# Altium schematic sheet Peripherals.SchDoc
size A4
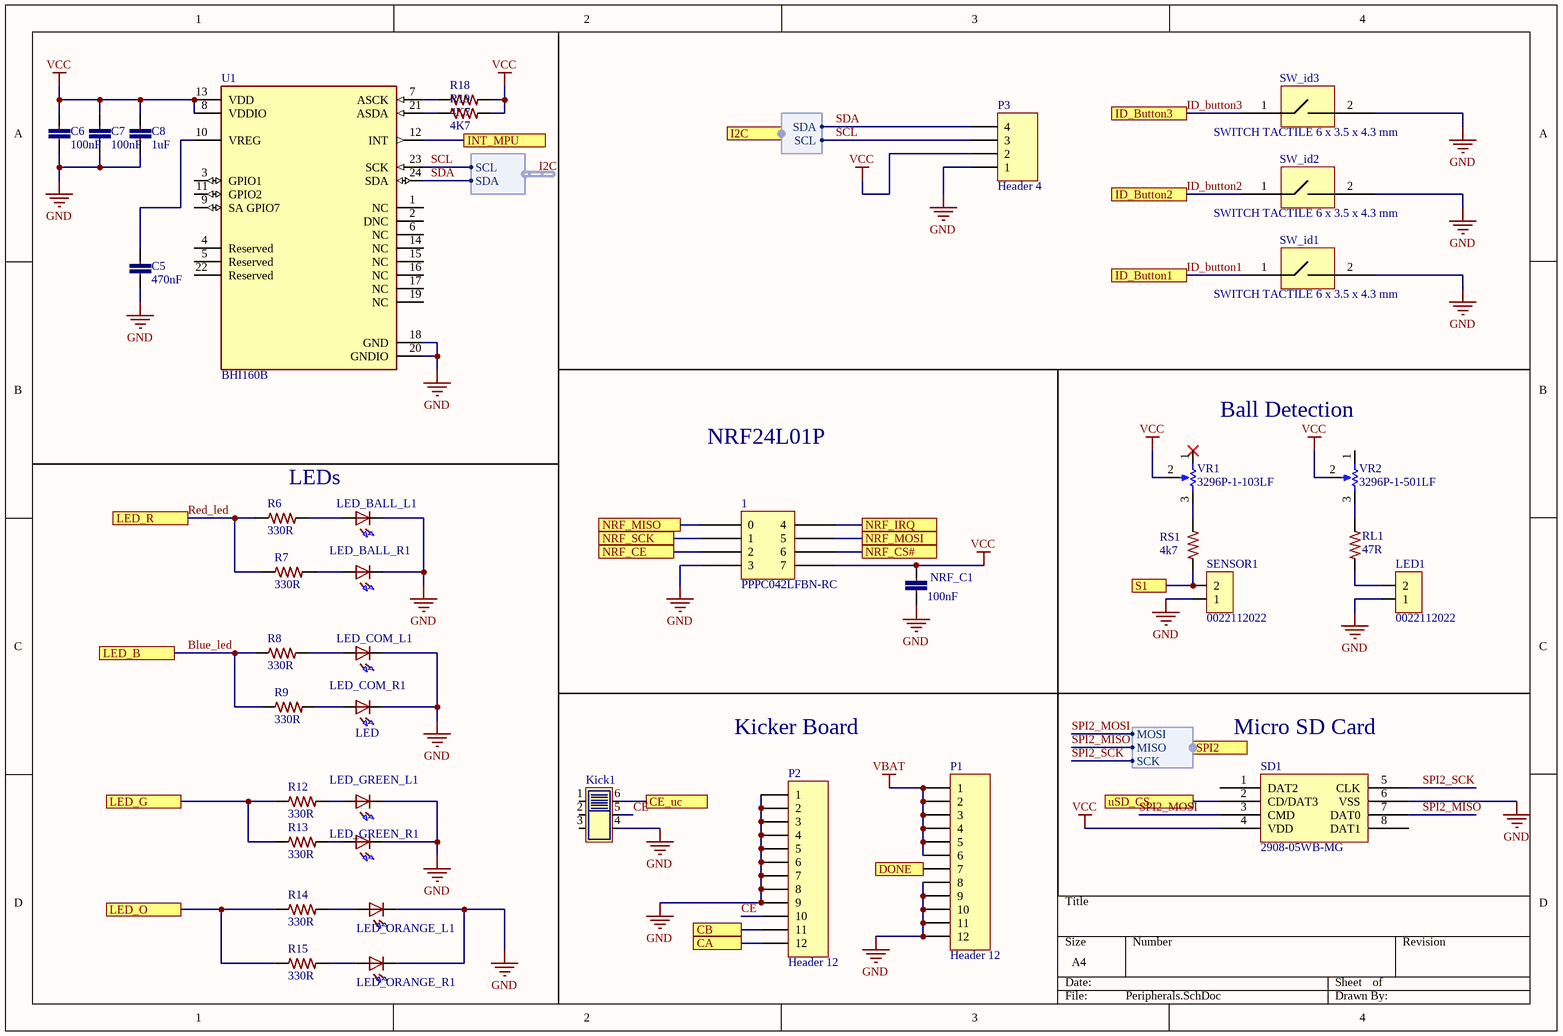
[diagram p0: Peripherals.SchDoc]

## Parts
1  PPPC042LFBN-RC  [04x02_Conector_Female]
C5  470nF  [0402-CAP]
C6  100nF  [0402-CAP]
C7  100nF  [0402-CAP]
C8  1uF  [0402-CAP]
Kick1  JS202011SCQN  [SOP250P750X350-6N]  (value not drawn)
LED1  0022112022  [02x01_Conector_Male]
LED_BALL_L1  LED  [LED-5MM-PCB]  (value not drawn)
LED_BALL_R1  LED  [LED-5MM-PCB]  (value not drawn)
LED_COM_L1  LED  [LED-5MM-PCB]  (value not drawn)
LED_COM_R1  LED  [LED-5MM-PCB]
LED_GREEN_L1  LED  [LED-5MM-PCB]  (value not drawn)
LED_GREEN_R1  LED  [LED-5MM-PCB]  (value not drawn)
LED_ORANGE_L1  LED  [LED-5MM-PCB]  (value not drawn)
LED_ORANGE_R1  LED  [LED-5MM-PCB]  (value not drawn)
NRF_C1  100nF  [0402-CAP]
P1  Header 12  [HDR1X12]
P2  Header 12  [HDR1X12]
P3  Header 4  [HDR1X4]
R6  330R  [0402-RES-HD]
R7  330R  [0402-RES-HD]
R8  330R  [0402-RES-HD]
R9  330R  [0402-RES-HD]
R12  330R  [0402-RES-HD]
R13  330R  [0402-RES-HD]
R14  330R  [0402-RES-HD]
R15  330R  [0402-RES-HD]
R18  4K7  [0805-RES]
R19  4K7  [0805-RES]
RL1  47R  [0402-RES-HD]
RS1  4k7  [0402-RES-HD]
SD1  2908-05WB-MG  [New footprint 1]
SENSOR1  0022112022  [02x01_Conector_Male]
SW_id1  SWITCH TACTILE 6 x 3.5 x 4.3 mm  [PCBComponent]
SW_id2  SWITCH TACTILE 6 x 3.5 x 4.3 mm  [PCBComponent]
SW_id3  SWITCH TACTILE 6 x 3.5 x 4.3 mm  [PCBComponent]
U1  BHI160B  [FP-BHI160B-MFG]
VR1  3296P-1-103LF  [3296P]
VR2  3296P-1-501LF  [3296P]

## Ports
CA, CB, CE_uc, DONE, I2C (harness I2C), ID_Button1, ID_Button2, ID_Button3, INT_MPU, LED_B, LED_G, LED_O, LED_R, NRF_CE, NRF_CS#, NRF_IRQ, NRF_MISO, NRF_MOSI, NRF_SCK, S1, SPI2 (harness SPI), uSD_CS

## Harnesses
I2C: SCL, SDA
SPI: MOSI, MISO, SCK

## Nets
GND: 1.3 C5.2 C6.2 C7.2 C8.2 Kick1.4 LED1.1 LED_BALL_L1.1(K) LED_BALL_R1.1(K) LED_COM_L1.1(K) LED_COM_R1.1(K) LED_GREEN_L1.1(K) LED_GREEN_R1.1(K) LED_ORANGE_L1.1(K) LED_ORANGE_R1.1(K) NRF_C1.2 P1.8 P1.9 P1.10 P1.11 P1.12 P2.1 P2.2 P2.3 P2.4 P2.5 P2.6 P2.7 P2.8 P2.9 P3.1 SD1.6(VSS) SENSOR1.1 SW_id1.2 SW_id2.2 SW_id3.2 U1.18(GND) U1.20(GNDIO)
VBAT: P1.1 P1.2 P1.3 P1.4 P1.5 P1.6
VCC: 1.7 C6.1 C7.1 C8.1 NRF_C1.1 P3.2 R18.2 R19.2 SD1.4(VDD) U1.8(VDDIO) U1.13(VDD) VR1.2(Wiper) VR2.2(Wiper)
Blue_led: R8.1 R9.1 ; port LED_B
CA: P2.12 ; port CA
CB: P2.11 ; port CB
CE: Kick1.5 P2.10
CE_uc: Kick1.6 ; port CE_uc
DONE: P1.7 ; port DONE
ID_button1: SW_id1.1 ; port ID_Button1
ID_button2: SW_id2.1 ; port ID_Button2
ID_button3: SW_id3.1 ; port ID_Button3
INT_MPU: U1.12(INT) ; port INT_MPU
LED_G: R12.1 R13.1 ; port LED_G
LED_O: R14.1 R15.1 ; port LED_O
NRF_CE: 1.2 ; port NRF_CE
NRF_CS#: 1.6 ; port NRF_CS#
NRF_IRQ: 1.4 ; port NRF_IRQ
NRF_MISO: 1.0 ; port NRF_MISO
NRF_MOSI: 1.5 ; port NRF_MOSI
NRF_SCK: 1.1 ; port NRF_SCK
Red_led: R6.1 R7.1 ; port LED_R
S1: RS1.1 SENSOR1.2 ; port S1
SCL: P3.3 U1.23(SCK) ; port I2C.SCL, harness I2C.SCL  [project net I2C.SCL]
SDA: P3.4 U1.24(SDA) ; port I2C.SDA, harness I2C.SDA  [project net I2C.SDA]
SPI2_MISO: SD1.7(DAT0) ; port SPI2.MISO
SPI2_MOSI: SD1.3(CMD) ; port SPI2.MOSI
SPI2_SCK: SD1.5(CLK) ; port SPI2.SCK
uSD_CS: SD1.2(CD/DAT3) ; port uSD_CS
NetC5_1: C5.1 U1.10(VREG)
NetLED1_2: LED1.2 RL1.2
NetLED_BALL_L1_2: LED_BALL_L1.2(A) R6.2
NetLED_BALL_R1_2: LED_BALL_R1.2(A) R7.2
NetLED_COM_L1_2: LED_COM_L1.2(A) R8.2
NetLED_COM_R1_2: LED_COM_R1.2(A) R9.2
NetLED_GREEN_L1_2: LED_GREEN_L1.2(A) R12.2
NetLED_GREEN_R1_2: LED_GREEN_R1.2(A) R13.2
NetLED_ORANGE_L1_2: LED_ORANGE_L1.2(A) R14.2
NetLED_ORANGE_R1_2: LED_ORANGE_R1.2(A) R15.2
NetR18_1: R18.1 U1.7(ASCK)
NetR19_1: R19.1 U1.21(ASDA)
NetRL1_1: RL1.1 VR2.3(CW)
NetRS1_2: RS1.2 VR1.3(CW)

Not connected (* = marked no-connect by the designer): Kick1 1 2 3; SD1 1(DAT2) 8(DAT1); U1 1(NC) 2(DNC) 3(GPIO1) 4(Reserved) 5(Reserved) 6(NC) 9(SA_GPIO7) 11(GPIO2) 14(NC) 15(NC) 16(NC) 17(NC) 19(NC) 22(Reserved); VR1 1(CCW)*; VR2 1(CCW)

## Notes on the sheet
- NRF24L01P
- Ball Detection
- LEDs
- Kicker Board
- (near SD1) Micro SD Card

## Library data of the parts
1 = 04x02_Conector_Female: 8 Position Header Connector 0.100" (2.54mm) Through Hole Gold
C5 = CMP-00169-1: CAP CER 0402 470nF 25V X5R; Part No: C1005X5R1E474K050; Cod EMS: 05.281.019.543; Value: 470nF; Component Type: Capacitor
C6 C7 NRF_C1 = CC0402-100nF-A.12: CAP CER 0.1UF 10V 20% X5R 0402; Part No: VJ0402V104ZXQPBC; Cod EMS: 05.281.006.133; Value: 100n
C8 = CC0402-1uF-5: CAP CER 1UF 6.3V 10% X5R 0402; Part No: JMK105BJ105KV-F; Cod EMS: 05.281.019.513; Value: 1u
Kick1 = JS202011SCQN-1: SWITCH SLIDE DPDT 300MA 6V; Part No: JS202011SCQN
LED1 SENSOR1 = 02x01_Conector_Male: CONN HEADER 2POS .100 VERT GOLD
LED_BALL_L1 LED_BALL_R1 LED_COM_L1 LED_COM_R1 LED_GREEN_L1 LED_GREEN_R1 LED_ORANGE_L1 LED_ORANGE_R1 = LED-5MM-3: LED 5MM PTH
P1 P2 = Header 12: Header, 12-Pin; LatestRevisionDate: 17-Jul-2002; LatestRevisionNote: Re-released for DXP Platform.; Publisher: Altium Limited
P3 = Header 4: Header, 4-Pin; LatestRevisionDate: 17-Jul-2002; LatestRevisionNote: Re-released for DXP Platform.; Publisher: Altium Limited
R6-R9 R12-R15 = R0402-330R-7: RES 330 OHM 1/10W 1% 0402 SMD; Part No: ERJ-2RKF3300X; Cod EMS: 05.280.029.506; Value: 330; Family Description: RESISTOR FILME ESPESSO 10R-1M / 1/10W / 1% / 0402. P/N: ERJ-2RKF....X – PANASONIC ELECTRONIC COMPONENTS.; Family: ERJ-2RKF....X
R18 R19 = R0805-4K7-1: RES SMD 4.7K OHM 1% 1/8W 0805; Part No: CRCW08054K70FKEA; Cod EMS: 05.280.029.425; Family: CRCW; Value: 4K7
RL1 = R0402-100R-5: RES 47 OHM 1/10W 1% 0402 SMD; Part No: ERJ-2RKF1000X; Value: 100; Cod EMS: 05.280.029.519; Family Description: RESISTOR FILME ESPESSO 10R-1M / 1/10W / 1% / 0402. P/N: ERJ-2RKF....X – PANASONIC ELECTRONIC COMPONENTS.; Family: ERJ-2RKF....X
RS1 = R0402-330R-7: RES 4k7 OHM 1/10W 1% 0402 SMD; Part No: ERJ-2RKF3300X; Value: 330; Cod EMS: 05.280.029.506; Family Description: RESISTOR FILME ESPESSO 10R-1M / 1/10W / 1% / 0402. P/N: ERJ-2RKF....X – PANASONIC ELECTRONIC COMPONENTS.; Family: ERJ-2RKF....X
SD1 = 2908-05WB-MG-01.A.1: CONN MICRO SD CARD PUSH-PUSH R/A
SW_id1-SW_id3 = 95C04A3GWRT.-1: GRAYHILL TACT,GW,6X3.5,1800T&R,LF Eight, 160g Operating Force, Gull Wing, RoHS Compliant; Part No: 95C04A3GWRT
U1 = CMP-191067-000004-1: IMU ACCEL/GYRO 3-AXIS I2C 24LGA; Manufacturer: Bosch Sensortec; Accel Resolution: 16bits; Operating Supply Current: 300-800uA; Sensor Type: Temperature,Accelerometer,Gyroscope; Accel Range: 2/4/8/16g; Gyro Sensitivity: 16.4/32.8/65.6/131.2/262.4LSB/°/s; Min Supply Voltage: 1.6V; Gyro Range: 125/250/500/1000/2000°/s; Accel Sensitivity: 2048/4096/8192/16384LSB/g; Max Supply Voltage: 3.6V; Sensor Output: I2C; Lead Free: Yes; Temperature: -40°C to +85°C; Height: 1mm; Ambient Temperature Range High: +85°C; Manufacturer Part Number: BHI160B; Temperature Range Low: -40°C; Category: IC; Octopart: https://octopart.com/bhi160b-bosch+sensortec-108216126; ComponentLink2URL: https://ae-bst.resource.bosch.com/media/_tech/media/datasheets/BST-BHI160B-DS000.pdf; RoHS: TRUE; Ambient Temperature Range Low: -40°C; Digikey Description: IMU ACCEL/GYRO 3-AXIS I2C 24LGA; Device Class L1: Sensors; Temperature Range High: +85°C; ComponentLink2Description: Datasheet; Package: 0; Device Class L2: Motion Sensors; Device Class L3: Inertial Measurement Units (IMUs); Automotive: No; Resolution: 16bits
VR1 = 3296P-1-103LF: Trimmer;  Cermet;  Rest 10 Kilohms;  PCB;  25 Turns;  Pwr-Rtg 0.5W; Manufacturer: Bourns; Manufacturer Series: 3296; Number of Terminals/Pins: 3; Max Power Dissipation: 500mW; Tolerance: 10%; Resistance: 10kR; Number of Turns: 25; Temperature Coefficient: 100ppm/°C; Resistance Law: Linear; Actuator Orientation: Horizontal; Actuator Type: SCREW; Supplier 1: Digi-Key; Manufacturer Part Number: 3296P-1-103LF; RoHS: Yes; Category: Variable Resistors and Potentiometers; Stock 1: 416; Pricing 1: 1=2.41000, 10=2.11700, 25=1.89800, 50=1.82500, 100=1.75200, 250=1.67900, 500=1.38700, 1000=1.31400, 5000=1.09500 (USD); Mount: Through Hole,Panel,PCB; Number of Pins: 3; Weight: 0.03oz; Color: Blue; Terminal Finish: Tin; Min Operating Temperature: -55°C; Max Operating Temperature: 125°C; Package Quantity: 50; Packaging: Rail/Tube; Series: 3296; Power Rating: 500mW; Termination: Pin; Taper: Linear; Resistor Type: Cermet; Technology: CERMET; Resistance Tolerance: 10%; Type: Potentiometer; Length: 9.53mm; Width: 9.53mm; Height: 0.19inch; Depth: 11.55mm; Radiation Hardening: No; Lead Free: Lead Free; RoHS Compliant: Yes; Military Standard: Not; REACH SVHC: No SVHC; ComponentLink1URL: https://datasheet.ciiva.com/19459/1156752-19459714.pdf?src-supplier=Jameco; ComponentLink1Description: https://datasheet.ciiva.com/19459/1156752-19459714.pdf?src-supplier=Jameco; ComponentLink2URL: https://datasheet.ciiva.com/11830/0900766b8069ccf4-11830968.pdf?src-supplier=RSComponents; ComponentLink2Description: https://datasheet.ciiva.com/11830/0900766b8069ccf4-11830968.pdf?src-supplier=RSComponents; ComponentLink3URL: https://datasheet.ciiva.com/29122/447267-da-01-en-trimmer-tht3296p-1-103lf-10k-0-5w-29122348.pdf?src-supplier=Conrad; ComponentLink3Description: https://datasheet.ciiva.com/29122/447267-da-01-en-trimmer-tht3296p-1-103lf-10k-0-5w-29122348.pdf?src-supplier=Conrad; ComponentLink4URL: https://datasheet.ciiva.com/2158/3296-2158320.pdf?src-supplier=Digi-Key; ComponentLink4Description: https://datasheet.ciiva.com/2158/3296-2158320.pdf?src-supplier=Digi-Key; ComponentLink5URL: https://datasheet.ciiva.com/14173/ew3296-dat-e-14173048.pdf?src-supplier=Distrelec; ComponentLink5Description: https://datasheet.ciiva.com/14173/ew3296-dat-e-14173048.pdf?src-supplier=Distrelec; ComponentLink6URL: https://datasheet.ciiva.com/3266/3296-3266181.pdf?src-supplier=Avnet; ComponentLink6Description: https://datasheet.ciiva.com/3266/3296-3266181.pdf?src-supplier=Avnet; ComponentLink7URL: https://datasheet.ciiva.com/1131/1815117-1131225.pdf?src-supplier=Element14; ComponentLink7Description: https://datasheet.ciiva.com/1131/1815117-1131225.pdf?src-supplier=Element14; ComponentLink8URL: https://datasheet.ciiva.com/16714/70153578-16714831.pdf?src-supplier=Allied+Electronics; ComponentLink8Description: https://datasheet.ciiva.com/16714/70153578-16714831.pdf?src-supplier=Allied+Electronics
VR2 = 3296P-1-501LF: Res Cermet Trimmer 500 Ohm 10% 1/2W 25(Elec)Turn 2.19mm (9.53 X 11.55 X 4.83mm) Pin Thru-Hole Tube; Manufacturer: Bourns; Max Power Dissipation: 500mW; Resistance: 500R; Number of Turns: 25; Temperature Coefficient: 100ppm/°C; Supplier 1: Digi-Key; Manufacturer Part Number: 3296P-1-501LF; RoHS: Yes; Category: Variable Resistors and Potentiometers; Stock 1: 1167; Pricing 1: 1=2.58000, 10=2.26400, 25=2.03000, 50=1.95200, 100=1.87400, 250=1.79588, 500=1.48356, 1000=1.40548, 5000=1.17123 (USD); Mount: Panel,Through Hole,PCB; Weight: 0.03oz; Color: Blue; Min Operating Temperature: -55°C; Max Operating Temperature: 125°C; Package Quantity: 50; Packaging: Rail/Tube; Series: 3296; Tolerance: 10%; Power Rating: 500mW; Termination: Pin; Taper: Linear; Resistor Type: Cermet; Technology: CERMET; Resistance Tolerance: 10%; Length: 9.53mm; Width: 9.53mm; Height: 0.19inch; Depth: 11.55mm; Radiation Hardening: No; Lead Free: Lead Free; Military Standard: Not; REACH SVHC: No SVHC; ComponentLink1URL: https://datasheet.ciiva.com/11832/0900766b8069ccf4-11832224.pdf?src-supplier=RSComponents; ComponentLink1Description: https://datasheet.ciiva.com/11832/0900766b8069ccf4-11832224.pdf?src-supplier=RSComponents; ComponentLink2URL: https://datasheet.ciiva.com/1131/684085-1131232.pdf?src-supplier=Element14; ComponentLink2Description: https://datasheet.ciiva.com/1131/684085-1131232.pdf?src-supplier=Element14; ComponentLink3URL: https://datasheet.ciiva.com/29122/447272-da-01-en-trimmer-tht3296p-1-501lf-500-r-0-5w-29122358.pdf?src-supplier=Conrad; ComponentLink3Description: https://datasheet.ciiva.com/29122/447272-da-01-en-trimmer-tht3296p-1-501lf-500-r-0-5w-29122358.pdf?src-supplier=Conrad; ComponentLink4URL: https://datasheet.ciiva.com/2158/3296-2158318.pdf?src-supplier=Digi-Key; ComponentLink4Description: https://datasheet.ciiva.com/2158/3296-2158318.pdf?src-supplier=Digi-Key; ComponentLink5URL: https://datasheet.ciiva.com/3266/3296-3266511.pdf?src-supplier=Avnet; ComponentLink5Description: https://datasheet.ciiva.com/3266/3296-3266511.pdf?src-supplier=Avnet; ComponentLink6URL: https://datasheet.ciiva.com/16715/70153578-16715738.pdf?src-supplier=Allied+Electronics; ComponentLink6Description: https://datasheet.ciiva.com/16715/70153578-16715738.pdf?src-supplier=Allied+Electronics; ComponentLink7URL: https://datasheet.ciiva.com/30076/3296-30076157.pdf?src-supplier=Onlinecomponents.com; ComponentLink7Description: https://datasheet.ciiva.com/30076/3296-30076157.pdf?src-supplier=Onlinecomponents.com; ComponentLink8URL: https://datasheet.ciiva.com/15156/getdatasheetpartid-171371-15156762.pdf?src-supplier=Verical; ComponentLink8Description: https://datasheet.ciiva.com/15156/getdatasheetpartid-171371-15156762.pdf?src-supplier=Verical; ComponentLink9URL: https://datasheet.ciiva.com/16807/3296-16807529.pdf?src-supplier=Avnet+Europe; ComponentLink9Description: https://datasheet.ciiva.com/16807/3296-16807529.pdf?src-supplier=Avnet+Europe